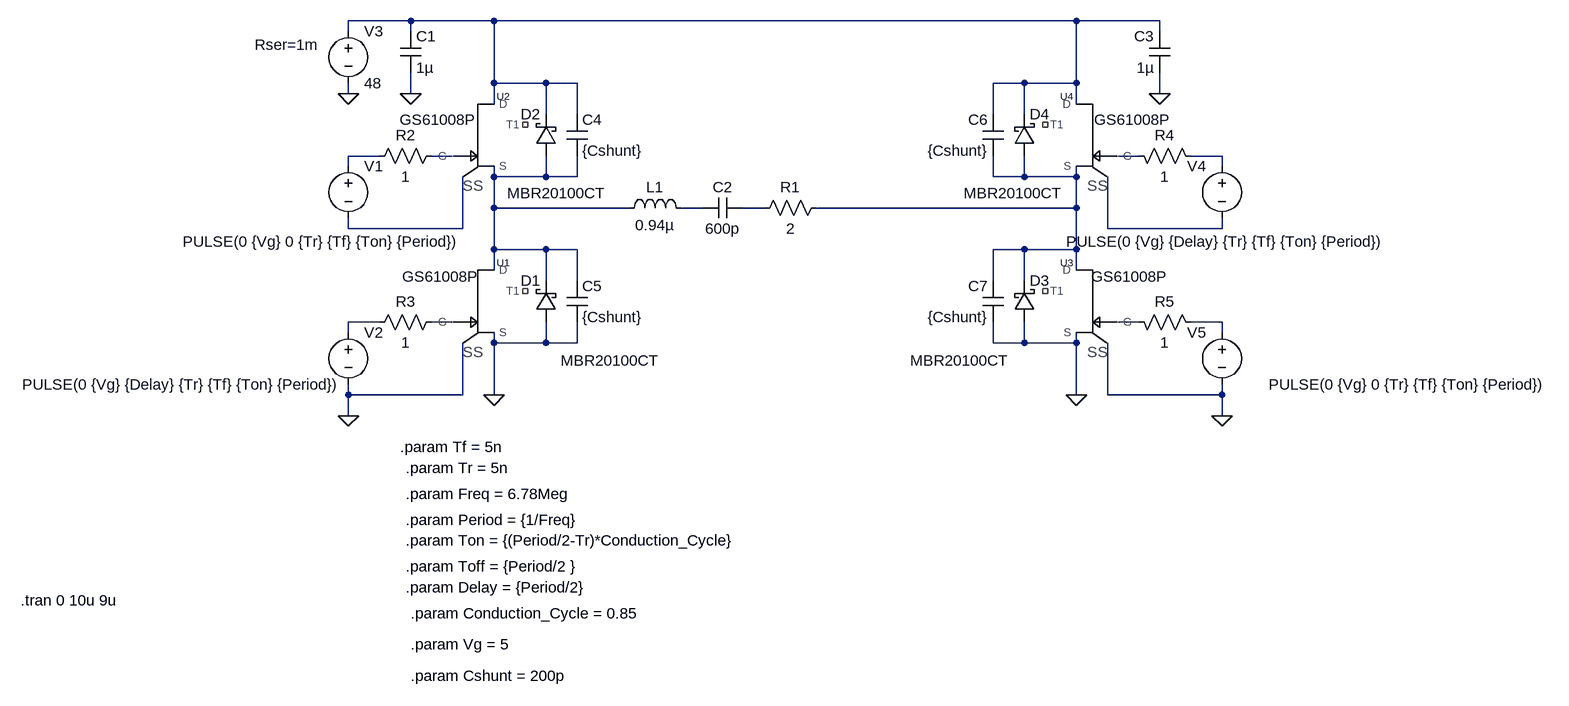
[diagram p0: schematic class_DE_bridge_benchmark.asc]
class_DE_bridge_benchmark.asc, the LTspice schematic file:
Version 4
SHEET 1 1844 784
WIRE 16 -240 -80 -240
WIRE 144 -240 16 -240
WIRE 1040 -240 144 -240
WIRE 1168 -240 1040 -240
WIRE -80 -224 -80 -240
WIRE 16 -224 16 -240
WIRE 1168 -224 1168 -240
WIRE 144 -144 144 -240
WIRE 224 -144 144 -144
WIRE 272 -144 224 -144
WIRE 960 -144 912 -144
WIRE 1040 -144 1040 -240
WIRE 1040 -144 960 -144
WIRE -80 -128 -80 -144
WIRE 16 -128 16 -160
WIRE 1168 -128 1168 -160
WIRE 144 -112 144 -144
WIRE 1040 -112 1040 -144
WIRE 224 -96 224 -144
WIRE 272 -96 272 -144
WIRE 912 -96 912 -144
WIRE 960 -96 960 -144
WIRE -32 -32 -80 -32
WIRE 80 -32 48 -32
WIRE 1136 -32 1104 -32
WIRE 1264 -32 1216 -32
WIRE -80 -16 -80 -32
WIRE 1264 -16 1264 -32
WIRE 144 0 144 -16
WIRE 224 0 224 -32
WIRE 224 0 144 0
WIRE 272 0 272 -32
WIRE 272 0 224 0
WIRE 912 0 912 -32
WIRE 960 0 960 -32
WIRE 960 0 912 0
WIRE 1040 0 1040 -16
WIRE 1040 0 960 0
WIRE 144 48 144 0
WIRE 352 48 144 48
WIRE 464 48 432 48
WIRE 560 48 528 48
WIRE 1040 48 1040 0
WIRE 1040 48 640 48
WIRE -80 80 -80 64
WIRE 96 80 96 0
WIRE 96 80 -80 80
WIRE 1088 80 1088 0
WIRE 1264 80 1264 64
WIRE 1264 80 1088 80
WIRE 144 112 144 48
WIRE 224 112 144 112
WIRE 272 112 224 112
WIRE 960 112 912 112
WIRE 1040 112 1040 48
WIRE 1040 112 960 112
WIRE 144 144 144 112
WIRE 1040 144 1040 112
WIRE 224 160 224 112
WIRE 272 160 272 112
WIRE 912 160 912 112
WIRE 960 160 960 112
WIRE -32 224 -80 224
WIRE 80 224 48 224
WIRE 1136 224 1104 224
WIRE 1264 224 1216 224
WIRE -80 240 -80 224
WIRE 1264 240 1264 224
WIRE 144 256 144 240
WIRE 224 256 224 224
WIRE 224 256 144 256
WIRE 272 256 272 224
WIRE 272 256 224 256
WIRE 912 256 912 224
WIRE 960 256 960 224
WIRE 960 256 912 256
WIRE 1040 256 1040 240
WIRE 1040 256 960 256
WIRE -80 336 -80 320
WIRE 96 336 96 256
WIRE 96 336 -80 336
WIRE 144 336 144 256
WIRE 1040 336 1040 256
WIRE 1088 336 1088 256
WIRE 1264 336 1264 320
WIRE 1264 336 1088 336
WIRE -80 368 -80 336
WIRE 1264 368 1264 336
FLAG 144 336 0
FLAG -80 368 0
FLAG -80 -128 0
FLAG 16 -128 0
FLAG 1040 336 0
FLAG 1264 368 0
FLAG 1168 -128 0
SYMBOL GaN_E-HEMT_LT_GS61008P 96 192 R0
WINDOW 3 -34 -38 Center 2
SYMATTR InstName U1
SYMBOL GaN_E-HEMT_LT_GS61008P 96 -64 R0
WINDOW 3 -38 -24 Center 2
SYMATTR InstName U2
SYMBOL voltage -80 -32 R0
WINDOW 3 -255 132 Left 2
WINDOW 123 0 0 Left 2
WINDOW 39 0 0 Left 2
SYMATTR InstName V1
SYMATTR Value PULSE(0 {Vg} 0 {Tr} {Tf} {Ton} {Period})
SYMBOL voltage -80 224 R0
WINDOW 3 -502 96 Left 2
WINDOW 123 0 0 Left 2
WINDOW 39 0 0 Left 2
SYMATTR InstName V2
SYMATTR Value PULSE(0 {Vg} {Delay} {Tr} {Tf} {Ton} {Period})
SYMBOL voltage -80 -240 R0
WINDOW 123 0 0 Left 2
WINDOW 39 -144 37 Left 2
SYMATTR InstName V3
SYMATTR Value 48
SYMATTR SpiceLine Rser=1m
SYMBOL cap 0 -224 R0
SYMATTR InstName C1
SYMATTR Value 1µ
SYMBOL ind 336 64 R270
WINDOW 0 32 56 VTop 2
WINDOW 3 5 56 VBottom 2
SYMATTR InstName L1
SYMATTR Value 0.94µ
SYMBOL cap 528 32 R90
WINDOW 0 0 32 VBottom 2
WINDOW 3 32 32 VTop 2
SYMATTR InstName C2
SYMATTR Value 600p
SYMBOL res 656 32 R90
WINDOW 0 0 56 VBottom 2
WINDOW 3 32 56 VTop 2
SYMATTR InstName R1
SYMATTR Value 2
SYMBOL res -48 -16 R270
WINDOW 0 32 56 VTop 2
WINDOW 3 0 56 VBottom 2
SYMATTR InstName R2
SYMATTR Value 1
SYMBOL res -48 240 R270
WINDOW 0 32 56 VTop 2
WINDOW 3 0 56 VBottom 2
SYMATTR InstName R3
SYMATTR Value 1
SYMBOL cap 256 -96 R0
SYMATTR InstName C4
SYMATTR Value {Cshunt}
SYMBOL cap 256 160 R0
SYMATTR InstName C5
SYMATTR Value {Cshunt}
SYMBOL schottky 240 224 R180
WINDOW 0 24 64 Left 2
WINDOW 3 -160 -59 Left 2
SYMATTR InstName D1
SYMATTR Value MBR20100CT
SYMBOL schottky 240 -32 R180
WINDOW 0 24 64 Left 2
WINDOW 3 -77 -57 Left 2
SYMATTR InstName D2
SYMATTR Value MBR20100CT
SYMBOL GaN_E-HEMT_LT_GS61008P 1088 192 M0
WINDOW 3 -34 -38 Center 2
SYMATTR InstName U3
SYMBOL GaN_E-HEMT_LT_GS61008P 1088 -64 M0
WINDOW 3 -38 -24 Center 2
SYMATTR InstName U4
SYMBOL voltage 1264 -32 M0
WINDOW 3 -255 132 Left 2
WINDOW 123 0 0 Left 2
WINDOW 39 0 0 Left 2
SYMATTR InstName V4
SYMATTR Value PULSE(0 {Vg} {Delay} {Tr} {Tf} {Ton} {Period})
SYMBOL voltage 1264 224 M0
WINDOW 3 -502 96 Left 2
WINDOW 123 0 0 Left 2
WINDOW 39 0 0 Left 2
SYMATTR InstName V5
SYMATTR Value PULSE(0 {Vg} 0 {Tr} {Tf} {Ton} {Period})
SYMBOL cap 1184 -224 M0
SYMATTR InstName C3
SYMATTR Value 1µ
SYMBOL res 1232 -16 M270
WINDOW 0 32 56 VTop 2
WINDOW 3 0 56 VBottom 2
SYMATTR InstName R4
SYMATTR Value 1
SYMBOL res 1232 240 M270
WINDOW 0 32 56 VTop 2
WINDOW 3 0 56 VBottom 2
SYMATTR InstName R5
SYMATTR Value 1
SYMBOL cap 928 -96 M0
SYMATTR InstName C6
SYMATTR Value {Cshunt}
SYMBOL cap 928 160 M0
SYMATTR InstName C7
SYMATTR Value {Cshunt}
SYMBOL schottky 944 224 M180
WINDOW 0 24 64 Left 2
WINDOW 3 -160 -59 Left 2
SYMATTR InstName D3
SYMATTR Value MBR20100CT
SYMBOL schottky 944 -32 M180
WINDOW 0 24 64 Left 2
WINDOW 3 -77 -57 Left 2
SYMATTR InstName D4
SYMATTR Value MBR20100CT
TEXT 0 416 Left 2 !.param Tf = 5n
TEXT 8 448 Left 2 !.param Tr = 5n
TEXT 8 488 Left 2 !.param Freq = 6.78Meg
TEXT 8 528 Left 2 !.param Period = {1/Freq}
TEXT 8 560 Left 2 !.param Ton = {(Period/2-Tr)*Conduction_Cycle}
TEXT 8 600 Left 2 !.param Toff = {Period/2 }
TEXT 8 632 Left 2 !.param Delay = {Period/2}
TEXT -584 652 Left 2 !.tran 0 10u 9u
TEXT 16 672 Left 2 !.param Conduction_Cycle = 0.85
TEXT 16 720 Left 2 !.param Vg = 5
TEXT 16 768 Left 2 !.param Cshunt = 200p

The netlist it stands for:
* class_DE_bridge_benchmark.asc
XU1 N013 N006 0 0 NC_01 GS61008P  ; pins G D S SS T1
XU2 N003 N001 N006 N010 NC_02 GS61008P  ; pins G D S SS T1
V1 N002 N010 PULSE(0 {Vg} 0 {Tr} {Tf} {Ton} {Period})
V2 N012 0 PULSE(0 {Vg} {Delay} {Tr} {Tf} {Ton} {Period})
V3 N001 0 48 Rser=1m
C1 N001 0 1µ
L1 N006 N008 0.94µ
C2 N009 N008 600p
R1 N007 N009 2
R2 N002 N003 1
R3 N012 N013 1
C4 N001 N006 {Cshunt}
C5 N006 0 {Cshunt}
D1 0 N006 MBR20100CT
D2 N006 N001 MBR20100CT
XU3 N014 N007 0 0 NC_03 GS61008P  ; pins G D S SS T1
XU4 N004 N001 N007 N011 NC_04 GS61008P  ; pins G D S SS T1
V4 N005 N011 PULSE(0 {Vg} {Delay} {Tr} {Tf} {Ton} {Period})
V5 N015 0 PULSE(0 {Vg} 0 {Tr} {Tf} {Ton} {Period})
C3 N001 0 1µ
R4 N005 N004 1
R5 N015 N014 1
C6 N001 N007 {Cshunt}
C7 N007 0 {Cshunt}
D3 0 N007 MBR20100CT
D4 N007 N001 MBR20100CT
.model D D
.lib standard.dio
.param Tf = 5n
.param Tr = 5n
.param Freq = 6.78Meg
.param Period = {1/Freq}
.param Ton = {(Period/2-Tr)*Conduction_Cycle}
.param Toff = {Period/2 }
.param Delay = {Period/2}
.tran 0 10u 9u
.param Conduction_Cycle = 0.85
.param Vg = 5
.param Cshunt = 200p
.lib GaN_LTspice_GS61008P_Release1p27.lib
.backanno
.end